# Altium schematic sheet 40M_PA.SchDoc: AX5243 40MHz Module
size A4; Date: 24.10.2017; DrawnBy: iv; Organization: FTG Heavy Industries; Revision: 0; SheetNumber: 1; SheetTotal: 1; DocumentName: AX5243 40MHz transceiver module main sheet; ProjectName: AX5243Module
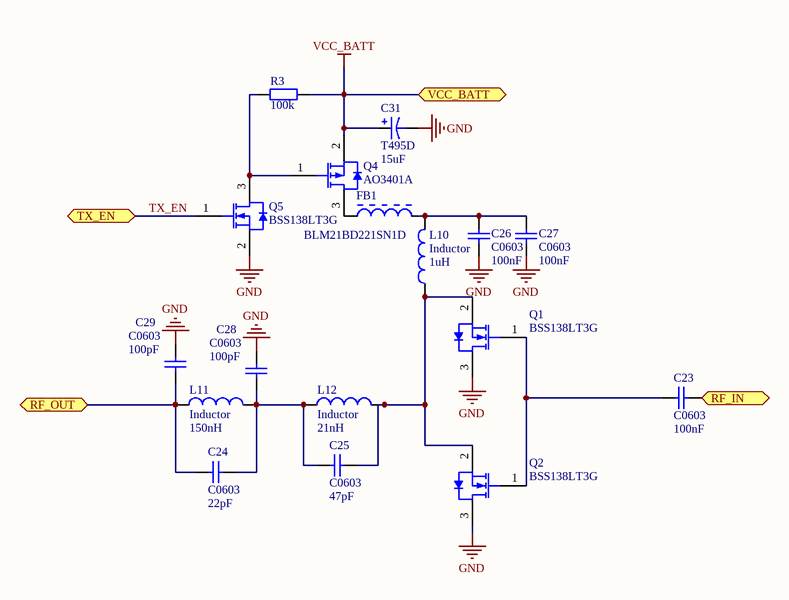
[diagram p0: 40M_PA.SchDoc]

## Parts
C23  C0603  value 100nF  [0603]
C24  C0603  value 22pF  [0603]
C25  C0603  value 47pF  [0603]
C26  C0603  value 100nF  [0603]
C27  C0603  value 100nF  [0603]
C28  C0603  value 100pF  [0603]
C29  C0603  value 100pF  [0603]
C31  T495D  value 15uF  [D]
FB1  BLM21BD221SN1D  [MURA-BLM21-H1-CHIP-2_V]
L10  Inductor  value 1uH  [INDC1608L]
L11  Inductor  value 150nH  [INDC1608L]
L12  Inductor  value 21nH  [INDC1608L]
Q1  BSS138LT3G  [ONSC-SOT-23-3-318-08_V]
Q2  BSS138LT3G  [ONSC-SOT-23-3-318-08_V]
Q4  AO3401A  [AO-SOT-23-3L_V]
Q5  BSS138LT3G  [ONSC-SOT-23-3-318-08_V]
R3  100k  [R0603]

## Ports
RF_IN, RF_OUT, TX_EN, VCC_BATT

## Nets
GND: C26.2 C27.2 C28.1 C29.1 C31.2 Q1.3(D) Q2.3(D) Q5.2(S)
VCC_BATT: C31.1 Q4.2(SOURCE) R3.2 ; port VCC_BATT
RF_IN: C23.2 ; port RF_IN
RF_OUT: C24.1 C29.2 L11.1 ; port RF_OUT
TX_EN: Q5.1(G) ; port TX_EN
NetC23_1: C23.1 Q1.1(G) Q2.1(G)
NetC24_2: C24.2 C25.1 C28.2 L11.2 L12.1
NetC25_2: C25.2 L10.1 L12.2 Q1.2(S) Q2.2(S)
NetC26_1: C26.1 C27.1 FB1.2 L10.2
NetFB1_1: FB1.1 Q4.3(DRAIN)
NetQ4_1: Q4.1(GATE) Q5.3(D) R3.1

## Library data of the parts
C23-C29 = C0603: Ceramic Chip Capacitor - Standard; Note: Footprint corresponds to dimensions for bulk cassette packaging. This case size has tightened tolerances.; Published: 17-Jul-2002; LatestRevisionDate: 19-Mar-2004; LatestRevisionNote: Silkscreen size reduced.; DatasheetDocument: Mar-2001; PackageDocument: Mar-2001; PackageReference: 0603; Publisher: Altium Limited; Code_JEITA: 0603; Code_IPC: 1608 [0603]; ComponentLink1Description: Manufacturer Link; ComponentLink1URL: http://www.kemet.com/; ComponentLink2Description: Datasheet; ComponentLink2URL: http://www.kemet.com/kemet/web/homepage/kechome.nsf/vapubfilesname/F3102TA.pdf/$file/F3102TA.pdf
C31 = T495D: Solid Tantalum Chip Capacitor, Standard T495 Series - Low ESR, Surge Robust; Published: 17-Jul-2002; LatestRevisionDate: 19-Mar-2004; LatestRevisionNote: Silkscreen dimensions re-sized.; DatasheetDocument: Mar-2001; PackageDocument: Mar-2001; PackageReference: D; Publisher: Altium Limited; Code_JEITA: 7343-31; ComponentLink1Description: Manufacturer Link; ComponentLink1URL: http://www.kemet.com/; ComponentLink2Description: Datasheet; ComponentLink2URL: http://www.kemet.com/kemet/web/homepage/kechome.nsf/vapubfilesname/F3102TA.pdf/$file/F3102TA.pdf
FB1 = CMP-0686-00656-2: Chip Ferrite Bead for High Speed Signal lines, 220 Ohm, 200 mA, -55 to 125 degC, 2 x 1.25 x 1.05 mm SMD, Tape and Reel; Manufacturer: Murata; Rated Current: 200 mA; Impedance (at 100 MHz): 220 Ohm +/- 25%; DC Resistance: 0.25 Ohm Max.; PackageDescription: 2-Pin Chip, Body 2 x 1.25 mm; Operating Temperature Range: -55 to 125 degC; ComponentLink3Description: Package Specification; ComponentLink2URL: http://www.murata.com/products/catalog/pdf/c31e.pdf; DatasheetVersion: 08/2013; PackageReference: BLM21_H1050-2; Packing: Tape and Reel; ComponentLink1Description: Manufacturer URL; ComponentLink3URL: http://www.murata.com/products/catalog/pdf/c31e.pdf; PartNumber: BLM21BD221SN1D; ComponentLink1URL: http://www.murata.com/; ComponentLink2Description: Datasheet; Mounting Technology: Surface Mount
L10-L12 = Inductor: Code_IEC: 1005; Published: 8-Jun-2000; LatestRevisionDate: 29-May-2009; LatestRevisionNote: IPC-7351 Footprint Added.; PackageReference: 0402-A; Publisher: Altium Limited; PackageDescription: Chip Inductor; Code_JEITA: 0402
Q1 Q2 Q5 = CMP-1058-00765-1: Power MOSFET, 200 mA, 50 V, N-Channel, 3-Pin SOT-23, Pb-Free, Tape and Reel; Manufacturer: On Semiconductor; PD Max (W): 0.225; Channel Polarity: N Channel; Crss Typ (pF): 3.5; Configuration: Single; ID Max (A): 0.2; Ciss Typ (pF): 40; V(BR)DSS Min (V): 50; VGS(th) Max (V): 1.5; Coss Typ (pF): 12; VGS Max (V): 20; ComponentLink2URL: http://www.onsemi.com/pub_link/Collateral/BSS138LT1-D.PDF; PackageDescription: 3-Pin Small Outline Transistor, Body 2.92 x 1.3 mm, Pitch 0.95 mm; Package Type: SOT-23-3; Mounting Technology: Surface Mount; ComponentLink1Description: Manufacturer URL; PackageVersion: Rev. AP, 11/2009; ComponentLink3Description: Package Specification; DatasheetVersion: Rev. 8; RoHS: Pb-Free; Packing: Tape and Reel; PackageReference: SOT-23-3-318-08; PartNumber: BSS138LT3G; ComponentLink3URL: http://www.onsemi.cn/pub_link/Collateral/318-08.PDF; ComponentLink1URL: http://www.onsemi.com/; ComponentLink2Description: Datasheet
Q4 = CMP-2000-05778-1: P-Channel MOSFET, 30 V, 4 A, -55 to 150 degC, 3-Pin SOT-23-3L, RoHS, Tape and Reel; Manufacturer: Alpha and Omega; Output Power (Max): NotRequiredW; Power Dissipation: 1.4W; Rad Hardened: No; Drain Efficiency: NotRequired%; Drain-Source On-Volt: 30V; Noise Figure: NotRequireddB; Frequency (Max): NotRequiredMHz; Number of  Elements: 1; Gate-Source Voltage (Max): ?12V; Drain Current (Max): 4A; Channel Mode: Enhancement; Drain-Source On-Res: 0.044ohm; Type: PowerMOSFET; Polarity: P; Package URL: http://www.aosmd.com/res/packaging_information/SOT-23-3L.pdf; Datasheet URL: http://www.aosmd.com/res/data_sheets/AO3401A.pdf; Package Type: SOT-23; Package Description: 3-Pin Small Outline Transistor, Body 2.95 x 1.6 mm, Pitch 0.95 mm; Mounting: SurfaceMount; Manufacturer URL: http://www.aosmd.com/; Continuous Drain Current: 4A; Package Reference: SOT-23-3L; Mounting Technology: SurfaceMount; Operating Temperature Classification: Military; Power Gain: NotRequireddB; Datasheet Version: Rev. 3, 03/2011; Operating Temp Range: -55Cto150C; Pin Count: 3
R3 = 1k 0603